# Altium schematic sheet 06_Digital.SchDoc
size A4; SheetNumber: 5; SheetTotal: 6
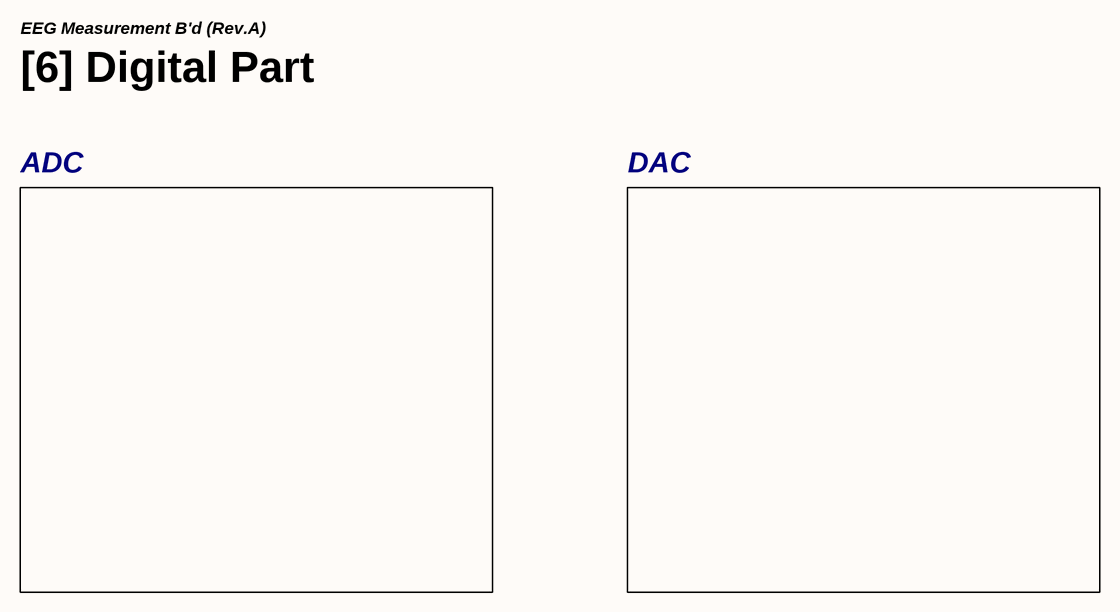
[diagram p0: 06_Digital.SchDoc]

## Notes on the sheet
- EEG Measurement B'd (Rev.A)
- [6] Digital Part
- ADC
- DAC
- Title
- Rev
- Doc
- Sheet #
- of
- Author
- This document is copyright of ArkX and shall not be revealed, produced, copied, in whole or in part,
- Date
- nor used for any purpose other than submitted.